# EAGLE schematic Eagle (EAGLE 7.1.0)
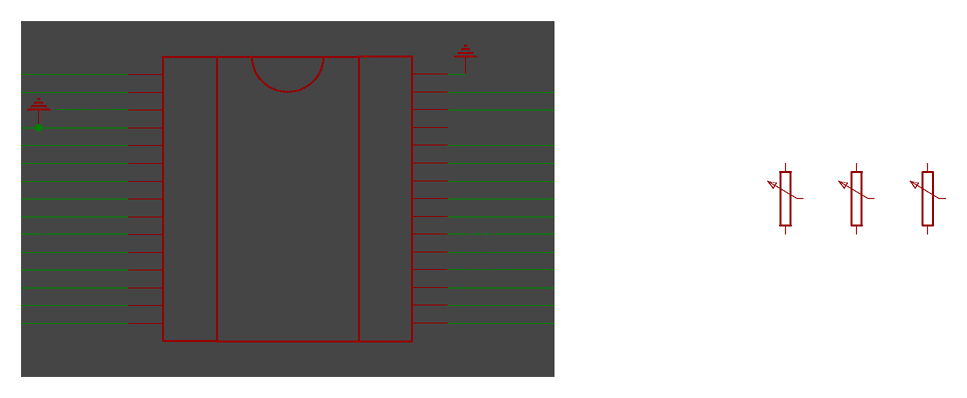
[diagram p0: schematic, sheet 1]

## Parts
J1  HEAD15-NOSS  [HEAD15-NOSS]
J2  HEAD15-NOSS-1  [HEAD15-NOSS-1]

## Nets
3V3: J2.14
A3: J2.9
A4: J2.8
A5: J2.7
A6: J2.6
A7: J2.5
AREF: J2.13
B$1: J2.10 J2.11 J2.12
COM: J2.1
D0/RX: J1.2
D1/TX: J1.1
D2: J1.5
D3: J1.6
D4: J1.7
D5: J1.8
D6: J1.9
D7: J1.10
D8: J1.11
D9: J1.12
D10: J1.13
D11/MOSI: J1.14
D12/MISO: J1.15
D13/SCK: J2.15
N$1: J1.4 ; supply symbol labelled COM
RES: J1.3
RESET: J2.3
VIN: J2.2
Unconnected: J2.4

## Library data of the parts
J1 = MyCON2:HEAD15-NOSS
J2 = MyCON2:HEAD15-NOSS-1